# EAGLE schematic main (EAGLE 9.4.0)
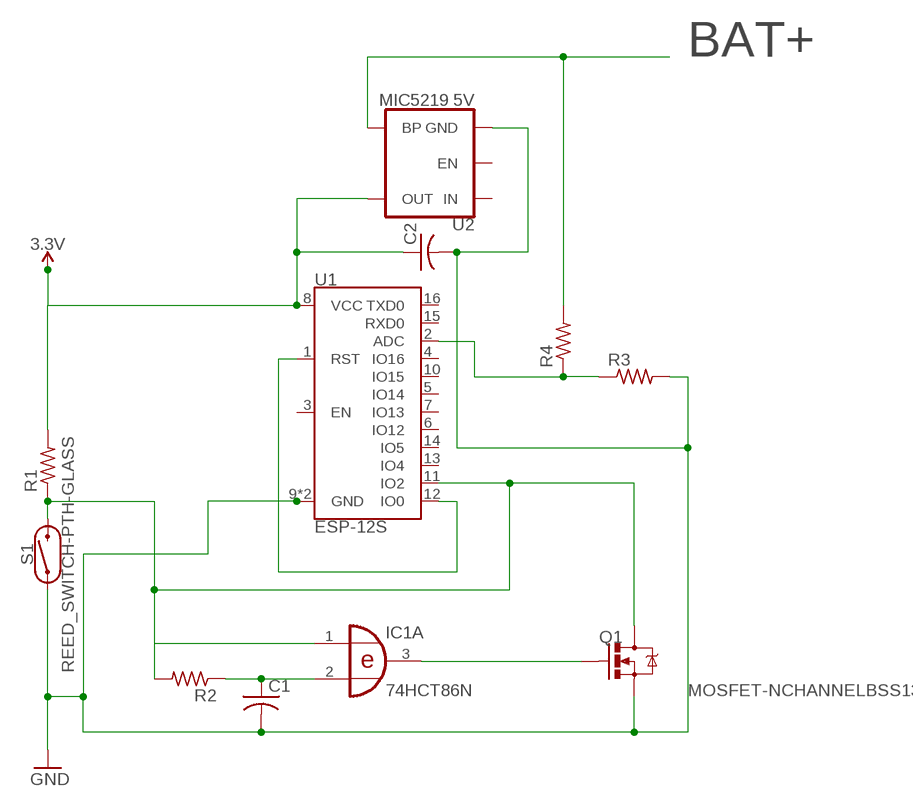
[diagram p0: schematic, sheet 1]

## Parts
C1  C-US025-050X050  [C025-050X050]
C2  C-US025-050X050  [C025-050X050]
IC1  74HCT86N  [DIL14]
Q1  MOSFET-NCHANNELBSS138  [SOT23]
R1  R-US_0411/15  [0411/15]
R2  R-US_0411/15  [0411/15]
R3  R-US_0411/15  [0411/15]
R4  R-US_0411/15  [0411/15]
S1  REED_SWITCH-PTH-GLASS  [REED_SWITCH_GLASS]
U1  ESP-12S  [ESP-12S]
U2  MIC5219 5V  V_REG_MIC52195V  [SOT23-5]

## Nets
3.3V: C2.1 R1.2 U1.8(VCC) U2.5(OUT)
BAT+: R4.2 U2.4(BP)
GND: C1.2 C2.2 Q1.2(S) R3.2 S1.P$1 U1.9(GND) U1.P$1(GND) U2.2(GND)
N$1: IC1.1(A:I0) Q1.3(D) R1.1 R2.2 S1.P$2 U1.11(IO2)
N$2: U1.1(RST) U1.12(IO0)
N$3: IC1.3(A:O) Q1.1(G)
N$4: C1.1 IC1.2(A:I1) R2.1
N$5: R3.1 R4.1 U1.2(ADC)
Unconnected: IC1.4(B:I0) IC1.5(B:I1) IC1.6(B:O) IC1.8(C:O) IC1.9(C:I0) IC1.10(C:I1) IC1.11(D:O) IC1.12(D:I0) IC1.13(D:I1) U1.3(EN) U1.4(IO16) U1.5(IO14) U1.6(IO12) U1.7(IO13) U1.10(IO15) U1.13(IO4) U1.14(IO5) U1.15(RXD0) U1.16(TXD0) U2.1(IN) U2.3(EN)

## Power pins joined to a net without a drawn wire
GND: IC1.7(P:GND)
VCC: IC1.14(P:VCC)

## Library data of the parts
C1 C2 = BeagleBone_Black_Wireless:C-US: CAPACITOR, American symbol
IC1 = 74xx-eu:74*86: Quad 2-input EXCLUSIVE-OR (XOR) gate
Q1 = BeagleBone_Blue_R3:MOSFET-NCHANNEL: Common NMOSFET Parts MFG P/N Store ID Prod ID FDD8780 TRANS-09984 SI7820DN TRANS-11055 FDS6630A IC-08089 2N7002PW TRANS-11151 FQP30N06L COM-10213 TRANS-10060 BSS123LT1G TRANS-08345 BSS138 TRANS-00830 BS170 2N7000; PROD_ID: TRANS-00830
R1-R4 = adafruit:R-US_: RESISTOR, American symbol
S1 = SparkFun-Switches:REED_SWITCH: Reed Switch A reed switch is a magnetically-actuated switch. When the device is exposed to a magnetic field, the two ferrous materials inside the switch pull together and the switch closes. Variant Overview PTH-GLASS Reed Switch <https://www.sparkfun.com/products/8642> (COM-08642) - PTH reed switch w/ glass body (6.0 x 0.9 mm) PTH-INSULATED Reed Switch - Insulated <https://www.sparkfun.com/products/10601> (COM-10601) - PTH reed switch w/ insulated body (15.1 x 4.2 mm); PROD_ID: SWCH-09282; SF_SKU: COM-08642
U1 = SparkFun-RF:ESP-12S: AI-Thinker ESP-12S ESP-12S WiFi module is developed by AI-Thinker Co.,Ltd, core processor ESP8266 in smaller sizes of the module encapsulates Tensilica L106 integrates industry-leading ultra low power 32-bit MCU micro, with the 16-bit short mode, clock speed support 80 MHz, 160 MHz, supports the RTOS, integrated Wi-Fi MAC/BB/RF/PA/LNA, on-board antennas.; PROD_ID: IC-14115
U2 = SparkFun-IC-Power:V_REG_MIC5219: V_REG MIC5219 Standard 3.3V and 5V 500mA LDO voltage regulator in SOT-23 layout. Micrel part MIC5219. BP (by-pass) pin is used to lower output noise with 470pF cap, may be left open.; PROD_ID: VREG-10107